# Altium schematic sheet PCB_TOP_LEVEL.SchDoc
size B; SheetNumber: 1; SheetTotal: 6
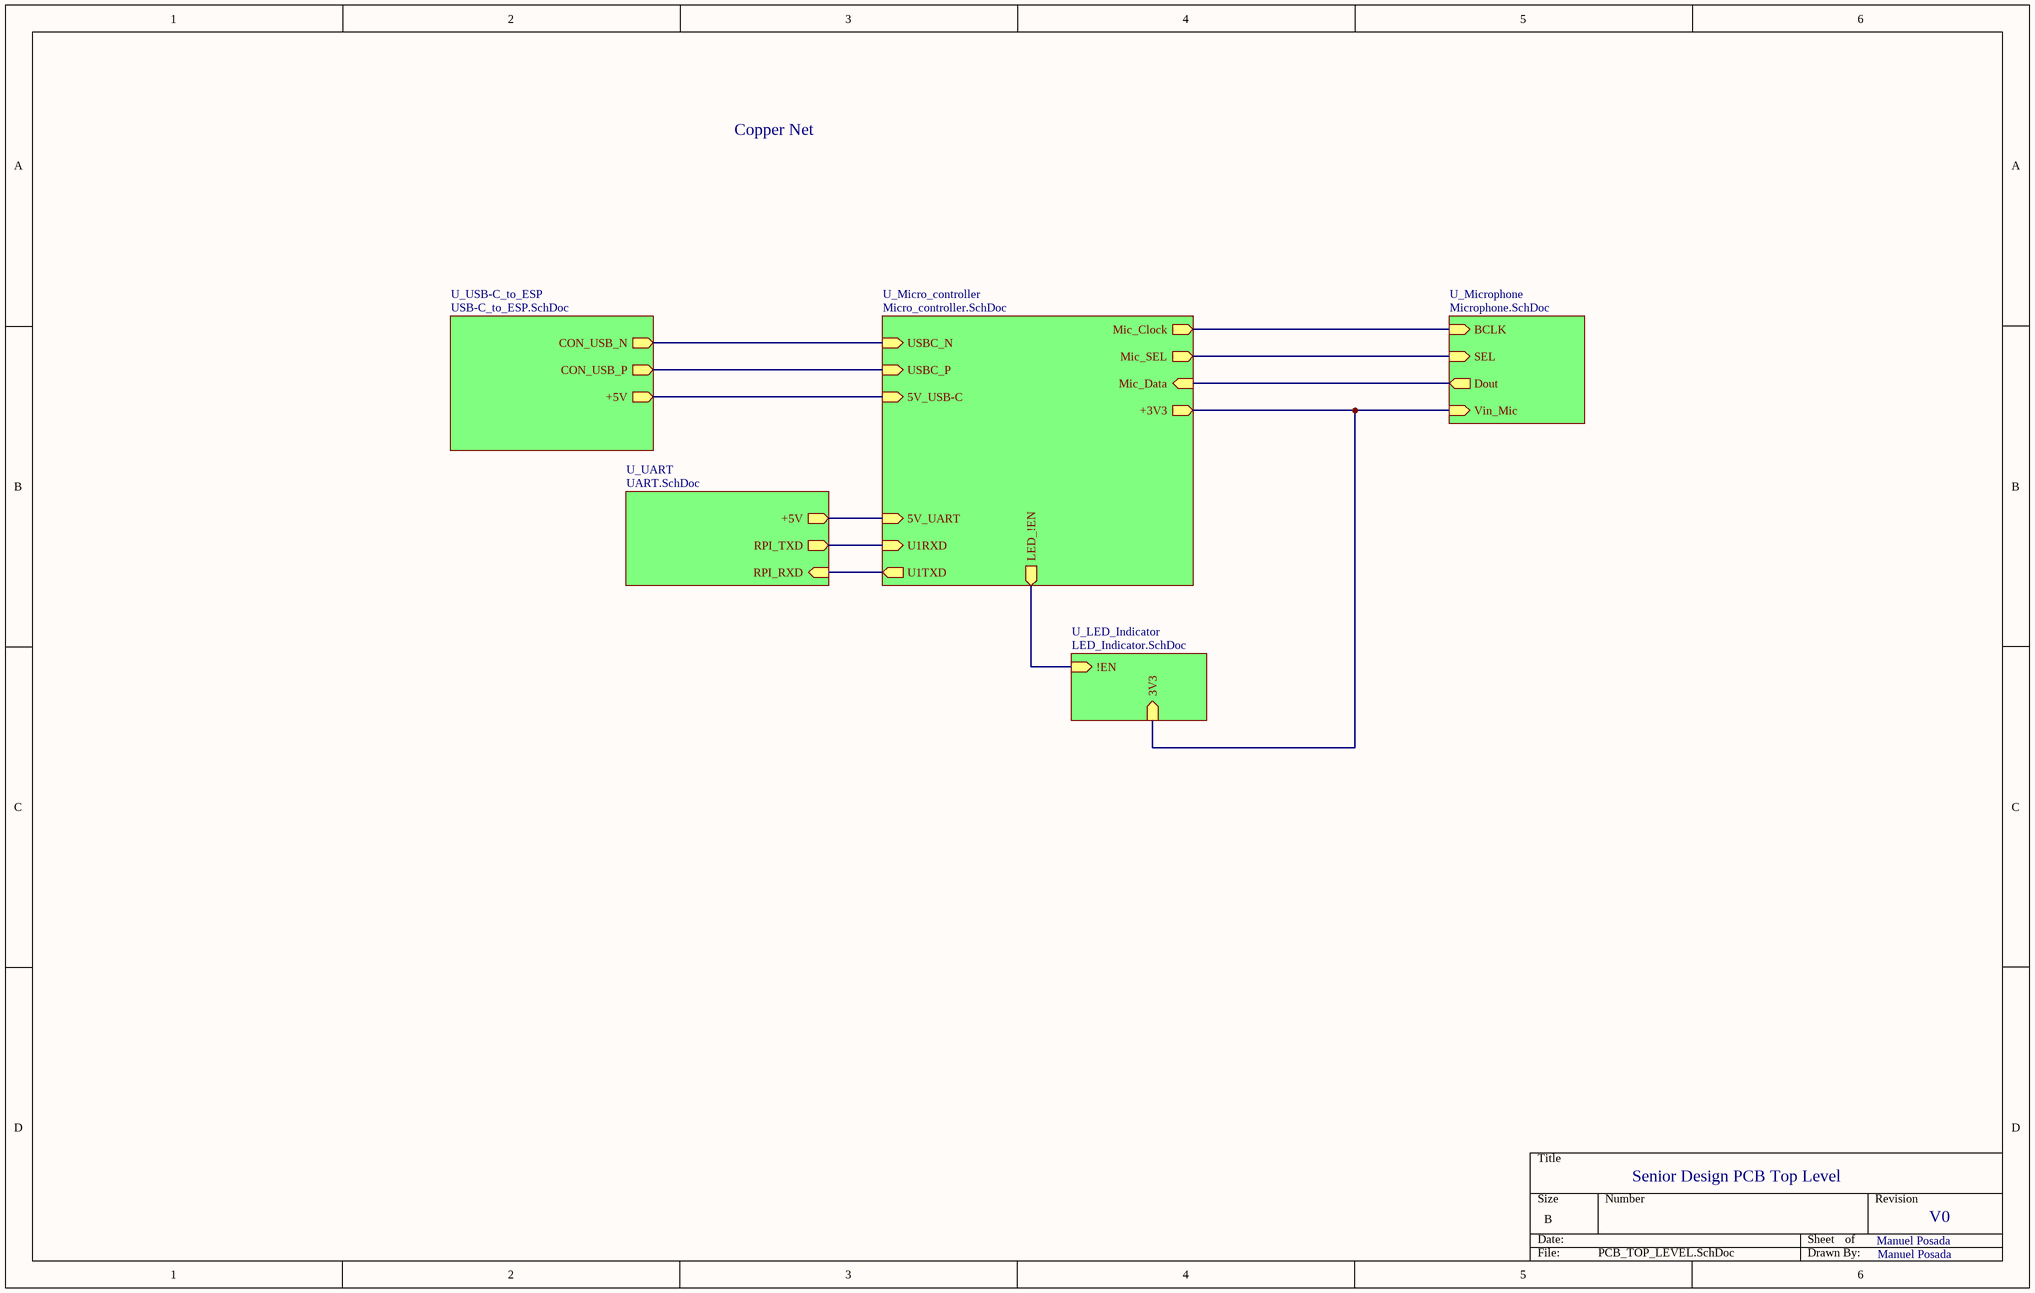
[diagram p0: PCB_TOP_LEVEL.SchDoc]

## Sub-sheets
U_LED_Indicator = LED_Indicator.SchDoc: 3V3 (in), !EN (in)
U_Micro_controller = Micro_controller.SchDoc: Mic_Data (in), Mic_SEL (out), Mic_Clock (out), U1TXD (out), U1RXD (in), LED_!EN (out), USBC_N (in), USBC_P (in), 5V_USB-C (in), 5V_UART (in), +3V3 (out)
U_Microphone = Microphone.SchDoc: Vin_Mic (in), BCLK (in), Dout (out), SEL (in)
U_UART = UART.SchDoc: RPI_RXD (in), RPI_TXD (out), +5V (out)
U_USB-C_to_ESP = USB-C_to_ESP.SchDoc: +5V (out), CON_USB_N (out), CON_USB_P (out)

## Nets
(unnamed): sheet U_Micro_controller/Mic_Data, sheet U_Microphone/Dout
(unnamed): sheet U_Micro_controller/Mic_SEL, sheet U_Microphone/SEL
(unnamed): sheet U_Micro_controller/Mic_Clock, sheet U_Microphone/BCLK
(unnamed): sheet U_Micro_controller/U1TXD, sheet U_UART/RPI_RXD
(unnamed): sheet U_Micro_controller/U1RXD, sheet U_UART/RPI_TXD
(unnamed): sheet U_Micro_controller/LED_!EN, sheet U_LED_Indicator/!EN
(unnamed): sheet U_Micro_controller/USBC_N, sheet U_USB-C_to_ESP/CON_USB_N
(unnamed): sheet U_Micro_controller/USBC_P, sheet U_USB-C_to_ESP/CON_USB_P
(unnamed): sheet U_Micro_controller/5V_USB-C, sheet U_USB-C_to_ESP/+5V
(unnamed): sheet U_Micro_controller/5V_UART, sheet U_UART/+5V
(unnamed): sheet U_Micro_controller/+3V3, sheet U_Microphone/Vin_Mic, sheet U_LED_Indicator/3V3

## Notes on the sheet
- Copper Net
- Senior Design PCB Top Level
- Manuel Posada
- V0